# Altium schematic sheet LM74700.SchDoc
size 431 x 279 mm; Date: Not shown in title block; ApprovedBy: Not shown in title block; CheckedBy: Not shown in title block; Author: Not shown in title block; CompanyName: Not shown in title block; DrawnBy: Andy Lin (TI); Engineer: Not shown in title block; Organization: Not shown in title block; Address1: Not shown in title block; Address2: Not shown in title block; Address3: Not shown in title block; Address4: Not shown in title block; DocumentNumber: 4; Revision: Use project parameter SCH_Rev; SheetNumber: 4; SheetTotal: 14; PageSetup: Record=PageOptions|CenterHorizontal=True|CenterVertical=True|PrintScale=1.00|XCorrection=1.00|YCorrection=1.00|PrintKind=0|BorderSize=5000000|LeftOffset=0|BottomOffset=0|Orientation=2|PaperLength=1000|PaperWidth=1000|Scale=100|PaperSource=15|PrintQuality=600|MediaType=1|DitherType=10|PaperKind=Letter|PrintScaleMode=1; CurrentTime: Not shown in title block; CurrentDate: Not shown in title block; Time: Not shown in title block; DocumentFullPathAndName: Not shown in title block; DocumentName: Not shown in title block; ModifiedDate: Not shown in title block; ImagePath: Not shown in title block
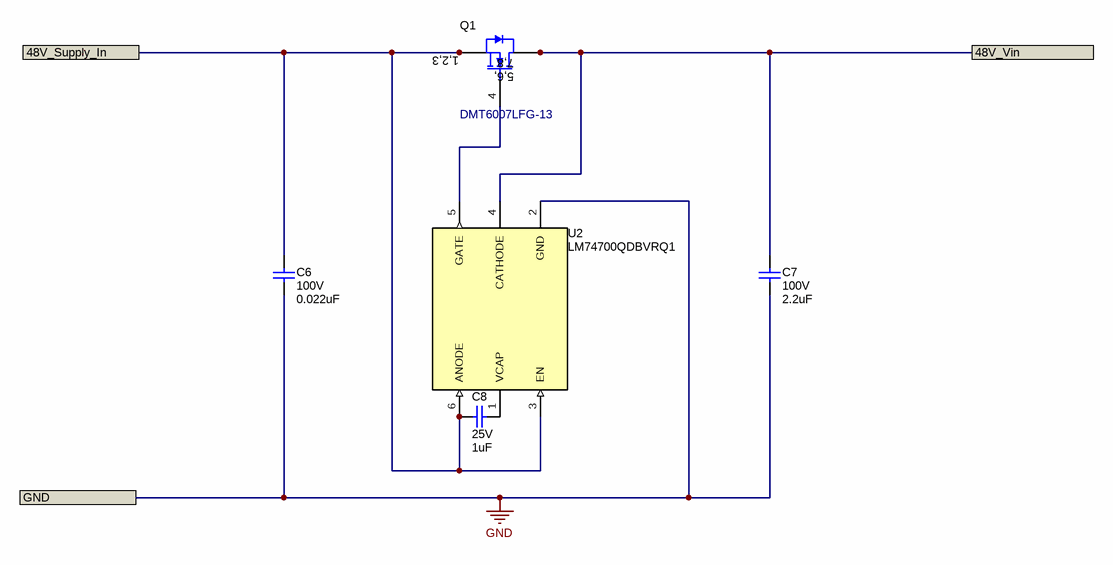
[diagram p0: LM74700.SchDoc]

## Parts
C6  VDC_V: 100V  ValueDisplayed: 0.022uF  [0805_HV]  (hidden comment: GRM21BR72A223KA01L)
C7  VDC_V: 100V  ValueDisplayed: 2.2uF  [1206_190]  (hidden comment: GRM31CR72A225KA73L)
C8  VDC_V: 25V  ValueDisplayed: 1uF  [0603]  (hidden comment: GCM188R71E105KA64D)
Q1  DMT6007LFG-13  [PowerDI3333-8]
U2  LM74700QDBVRQ1  [DBV0006A_N]

## Ports
48V_Supply_In, 48V_Vin, GND

## Nets
GND: C6.2 C7.2 U2.2(GND) ; port GND
48V_Supply_In: C6.1 C8.2 Q1.1(S) Q1.2(S) Q1.3(S) U2.3(EN) U2.6(ANODE) ; port 48V_Supply_In
48V_Vin: C7.1 Q1.5(D) Q1.6(D) Q1.7(D) Q1.8(D) Q1.9(D) U2.4(CATHODE) ; port 48V_Vin
NetC8_1: C8.1 U2.1(VCAP)
NetQ1_4: Q1.4(G) U2.5(GATE)

## Notes on the sheet
- Drawn By:
- SVN Rev:
- Number:
- TID #:
- Orderable:
- Rev:
- Sheet Title:
- File:
- Project Title:
- Designed for:
- Assembly Variant:
- Mod. Date:
- Sheet:
- Size:
- of
- B
- http://www.ti.com
- Texas Instruments and/or its licensors do not warrant the accuracy or completeness of this specification or any information contained therein. Texas Instruments and/or its licensors do not warrant that this design will meet the specifications, will be suitable for your application or fit for any particular purpose, or will operate in an implementation. Texas Instruments and/or its licensors do not warrant that the design is production worthy. You should completely validate and test your design implementation to confirm the system functionality for your application.
- Engineer:
- Contact:
- © Texas Instruments
- (in symbol CMP-0067553-1) 1,2,3; 7,8; 5,6,

## Library data of the parts
C6 = CMP-0008368-1: CAP, CERM, 0.022 uF, 100 V, +/- 10%, X7R, 0805; Manufacturer: MuRata; TaMin_C: -55°C; Polarized: N; SizeAreaWB_mm2: 6.75; Value1: Unknown; U/M: EA; TaMax_C: 125°C; SizeZ_mm: 1.45; SizeX_mm: 2; SizeY_mm: 1.25; Cap_Case: 0805; SizeArea_mm2: 2.5; Cap_F: 22nF; AEC Category: Q200; ComponentLink1URL: http://search.murata.co.jp/Ceramy/PnsearchViewAction.do?HnOFG=ON&HnNFG=ON&SEL_CNT=50&sLang=en&sKey=GRM21BR72A223KA01L&x=9&y=9&search=startwith; Supplier Part Number 2: 81-GRM21R72A223KA01L; Publisher: Texas Instruments; Supplier 2: Mouser; Supplier Part Number 3: 1403970; TempCo: X7R; Supplier 3: Farnell; Published: 2008-06-19; RoHS: Y; MountType: SMT; Value: 0.022uF; Supplier 1: Digi-Key; PackageReference: 0805; Tolerance_%: 10%; Value2: 100V; CompType: Capacitor; LatestRevisionDate: 2017-03-09; PartNumber: GRM21BR72A223KA01L; AEC Qualified: ?; ComponentLink1Description: Datasheet link; Supplier Part Number 1: 490-1658-1-ND; Technology: Ceramic
C7 = CMP-0008971-1: CAP, CERM, 2.2 uF, 100 V, +/- 10%, X7R, 1206_190; Manufacturer: MuRata; TaMin_C: -55°C; Polarized: N; SizeAreaWB_mm2: 10.92; Value1: Unknown; U/M: EA; Value: 2.2uF; TaMax_C: 125°C; SizeZ_mm: 1.9; SizeX_mm: 3.2; SizeY_mm: 1.6; Cap_Case: 1206; SizeArea_mm2: 5.12; Cap_F: 2.2µF; AEC Category: Q200; ComponentLink1URL: http://search.murata.co.jp/Ceramy/image/img/w_hinm/L0005E.pdf; Publisher: Texas Instruments; TempCo: X7R; Published: 2008-06-19; RoHS: Y; MountType: SMT; Supplier 1: Digi-Key; PackageReference: 1206_190; Tolerance_%: 10%; Value2: 100V; CompType: Capacitor; LatestRevisionDate: 2017-03-09; PartNumber: GRM31CR72A225KA73L; AEC Qualified: ?; ComponentLink1Description: Datasheet link; Supplier Part Number 1: 490-7209-1-ND; Technology: Ceramic
C8 = CMP-0007139-4: CAP, CERM, 1 uF, 25 V, +/- 10%, X7R, AEC-Q200 Grade 1, 0603; Manufacturer: MuRata; TaMin_C: -55°C; Polarized: N; SizeAreaWB_mm2: 4.68; Value1: Unknown; U/M: EA; Value: 1uF; TaMax_C: 125°C; SizeZ_mm: 1; SizeX_mm: 1.6; SizeY_mm: 0.8; SizeArea_mm2: 1.28; AEC Qualified: Y; Cap_F: 1µF; AEC Category: Q200; Supplier Part Number 2: 45Y5164; Publisher: Texas Instruments; Supplier 2: Newark; Supplier Part Number 3: 81-GCM188R71E105KA4D; TempCo: X7R; Supplier 3: Mouser; Published: 2008-06-19; RoHS: Y; MountType: SMT; Supplier 1: Digi-Key; PackageReference: 0603; Tolerance_%: 10%; Cap_Case: 0603; Value2: 25V; CompType: Capacitor; LatestRevisionDate: 2017-03-09; PartNumber: GCM188R71E105KA64D; ComponentLink1Description: Datasheet link; AEC Grade: 1; Supplier Part Number 1: 490-10673-1-ND; Technology: Ceramic; ComponentLink1URL: http://psearch.en.murata.com/capacitor/product/GCM188R71E105KA64%23.pdf
Q1 = CMP-0067553-1: MOSFET, N-CH, 60 V, 15 A, AEC-Q101, 8-PowerVDFN; Alternate Manufacturer: None; Manufacturer: Diodes Inc.; Rdson45_ohm: 8.5m; QgTyp_nC: 41.3; SizeAreaWB_mm2: 18.49; Vgs_V: 20V; Value1: 0.0085 ohm; VdsMax_V: 60V; U/M: EA; Value: 60V; IdsMax_A: 15A; SizeZ_mm: 0.8; SizeX_mm: 3.3; Value2: 41.3 nC; SizeArea_mm2: 10.89; ChType: N; AEC Qualified: Y; AEC Category: Q101; ComponentLink1URL: https://www.diodes.com/assets/Datasheets/DMT6007LFG.pdf; Supplier Part Number 2: 621-DMT6007LFG-13; Publisher: Texas Instruments; Supplier 2: Mouser; Published: 2008-06-19; RoHS: Y; MountType: SMT; Supplier 1: Digi-Key; LatestRevisionNote: Added parts.; PackageReference: 8-PowerVDFN; SizeY_mm: 3.3; CompType: MOSFET; LatestRevisionDate: 2017-06-05; PartNumber: DMT6007LFG-13; ComponentLink1Description: Datasheet link; Supplier Part Number 1: DMT6007LFG-13-ND
U2 = CMP-0013281-4: Low Iq Always ON Smart Diode Controller, DBV0006A (SOT-23-6); Alternate PartNumber: LM74700QDBVTQ1; Manufacturer: Texas Instruments; SizeZ_mm: 1.45; SizeX_mm: 2.8; SizeY_mm: 2.9; SizeArea_mm2: 8.12; CompType: IC; SizeAreaWB_mm2: 14.82; AEC Category: Q200; AEC Qualified: Y; ComponentLink1URL: http://www.ti.com/lit/ds/symlink/lm74700-q1.pdf; PackageDescription: SOT-23-6; PackageReference: DBV0006A; PartNumber: LM74700QDBVRQ1; ComponentLink1Description: Datasheet Link; MountType: SMT; Alternate Manufacturer: Texas Instruments; ComponentLink2Description: Product Folder; ComponentLink2URL: http://www.ti.com/product/lm74700-q1; ComponentLink3Description: Online Datasheet; ComponentLink3URL: http://www.ti.com/product/lm74700-q1/datasheet